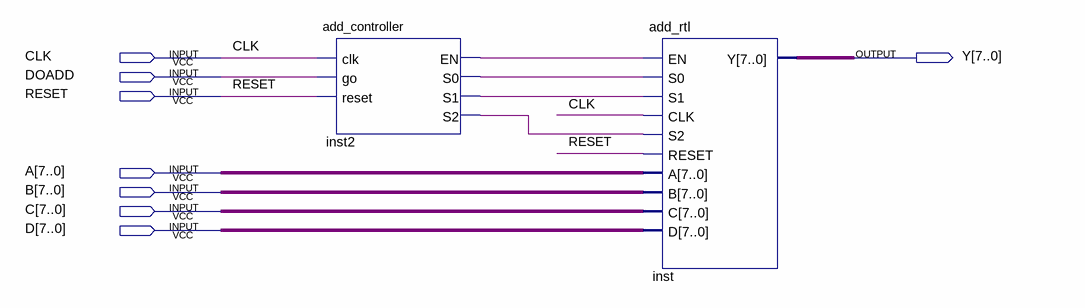
[diagram p0: schematic sheet]
// Quartus schematic Top.bdf as structural Verilog: 2 symbols, 8 pins
module Top (
  input  CLK,
  input  DOADD,
  input  RESET,
  input  [7:0] A,
  input  [7:0] B,
  input  [7:0] C,
  input  [7:0] D,
  output [7:0] Y
);

  wire inst2_en, inst2_s0, inst2_s1, inst2_s2;

  add_controller inst2 (
    .clk(CLK), .go(DOADD), .reset(RESET), .EN(inst2_en), .S0(inst2_s0), .S1(inst2_s1), .S2(inst2_s2));
  add_rtl inst (
    .EN(inst2_en), .S0(inst2_s0), .S1(inst2_s1), .CLK(CLK), .S2(inst2_s2), .RESET(RESET), .A(A), .B(B),
    .C(C), .D(D), .Y(Y));
endmodule
